# EAGLE design wooden_alarm_simple (EAGLE 9.6.2)
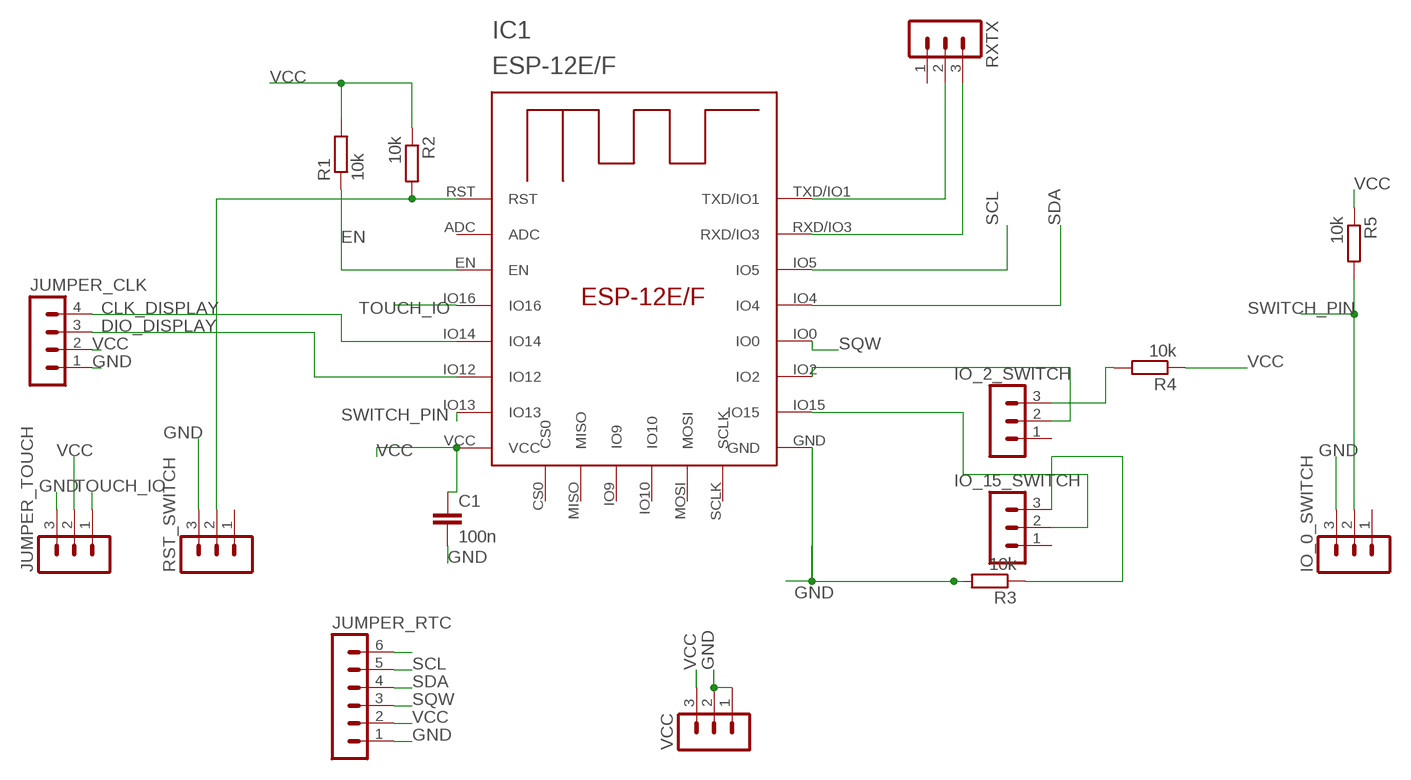
[diagram p0: schematic, sheet 1]

## Parts
C1  100n  C-EUC0805  [C0805]
IC1  ESP-12E/F  [ESP-12E]
IO_0_SWITCH  MA03-1  [MA03-1]
IO_2_SWITCH  MA03-1  [MA03-1]
IO_15_SWITCH  MA03-1  [MA03-1]
JUMPER_CLK  MA04-1  [MA04-1]
JUMPER_RTC  MA06-1  [MA06-1]
JUMPER_TOUCH  MA03-1  [MA03-1]
R1  10k  R-EU_R0805  [R0805]
R2  10k  R-EU_R0805  [R0805]
R3  10k  R-EU_R0805  [R0805]
R4  10k  R-EU_R0805  [R0805]
R5  10k  R-EU_R0805  [R0805]
RST_SWITCH  MA03-1  [MA03-1]
RXTX  MA03-1  [MA03-1]
VCC  MA03-1  [MA03-1]

## Nets
CLK_DISPLAY: IC1.IO14 JUMPER_CLK.4
DIO_DISPLAY: IC1.IO12 JUMPER_CLK.3
EN: IC1.EN R1.1
GND: C1.2 IC1.GND IO_0_SWITCH.3 JUMPER_CLK.1 JUMPER_RTC.1 JUMPER_TOUCH.3 R3.2 RST_SWITCH.3 VCC.1 VCC.2
N$1: IC1.RST R2.2 RST_SWITCH.2
N$2: IO_2_SWITCH.3 R4.2
N$3: IC1.IO15 IO_15_SWITCH.2
N$5: IO_15_SWITCH.3 R3.1
N$7: IC1.IO2 IO_2_SWITCH.2
N$14: JUMPER_RTC.6
RX: IC1.RXD/IO3 RXTX.3
SCL: IC1.IO5 JUMPER_RTC.5
SDA: IC1.IO4 JUMPER_RTC.4
SQW: IC1.IO0 JUMPER_RTC.3
SWITCH_PIN: IC1.IO13 IO_0_SWITCH.2 R5.2
TOUCH_IO: IC1.IO16 JUMPER_TOUCH.1
TX: IC1.TXD/IO1 RXTX.2
VCC: C1.1 IC1.VCC JUMPER_CLK.2 JUMPER_RTC.2 JUMPER_TOUCH.2 R1.2 R2.1 R4.1 R5.1 VCC.3
Unconnected: IC1.ADC IC1.CS0 IC1.IO9 IC1.IO10 IC1.MISO IC1.MOSI IC1.SCLK IO_0_SWITCH.1 IO_2_SWITCH.1 IO_15_SWITCH.1 RST_SWITCH.1 RXTX.1

## Library data of the parts
C1 = rcl:C-EU: CAPACITOR, European symbol; SPICEPREFIX: C
IC1 = esp-12e-f:ESP-12E/F
IO_0_SWITCH IO_2_SWITCH IO_15_SWITCH JUMPER_TOUCH RST_SWITCH RXTX VCC = con-lstb:MA03-1: PIN HEADER; OC_FARNELL: unknown; OC_NEWARK: unknown
JUMPER_CLK = con-lstb:MA04-1: PIN HEADER; OC_FARNELL: unknown; OC_NEWARK: unknown
JUMPER_RTC = con-lstb:MA06-1: PIN HEADER; OC_FARNELL: unknown; OC_NEWARK: unknown
R1-R5 = rcl:R-EU_: RESISTOR, European symbol; SPICEPREFIX: R

## Net classes
0 default: width 0.152 mm, drill 0.1 mm
1 other: width 0.152 mm, drill 0.1 mm, clearance 0.205 mm to class 0, clearance 0.205 mm

## Board
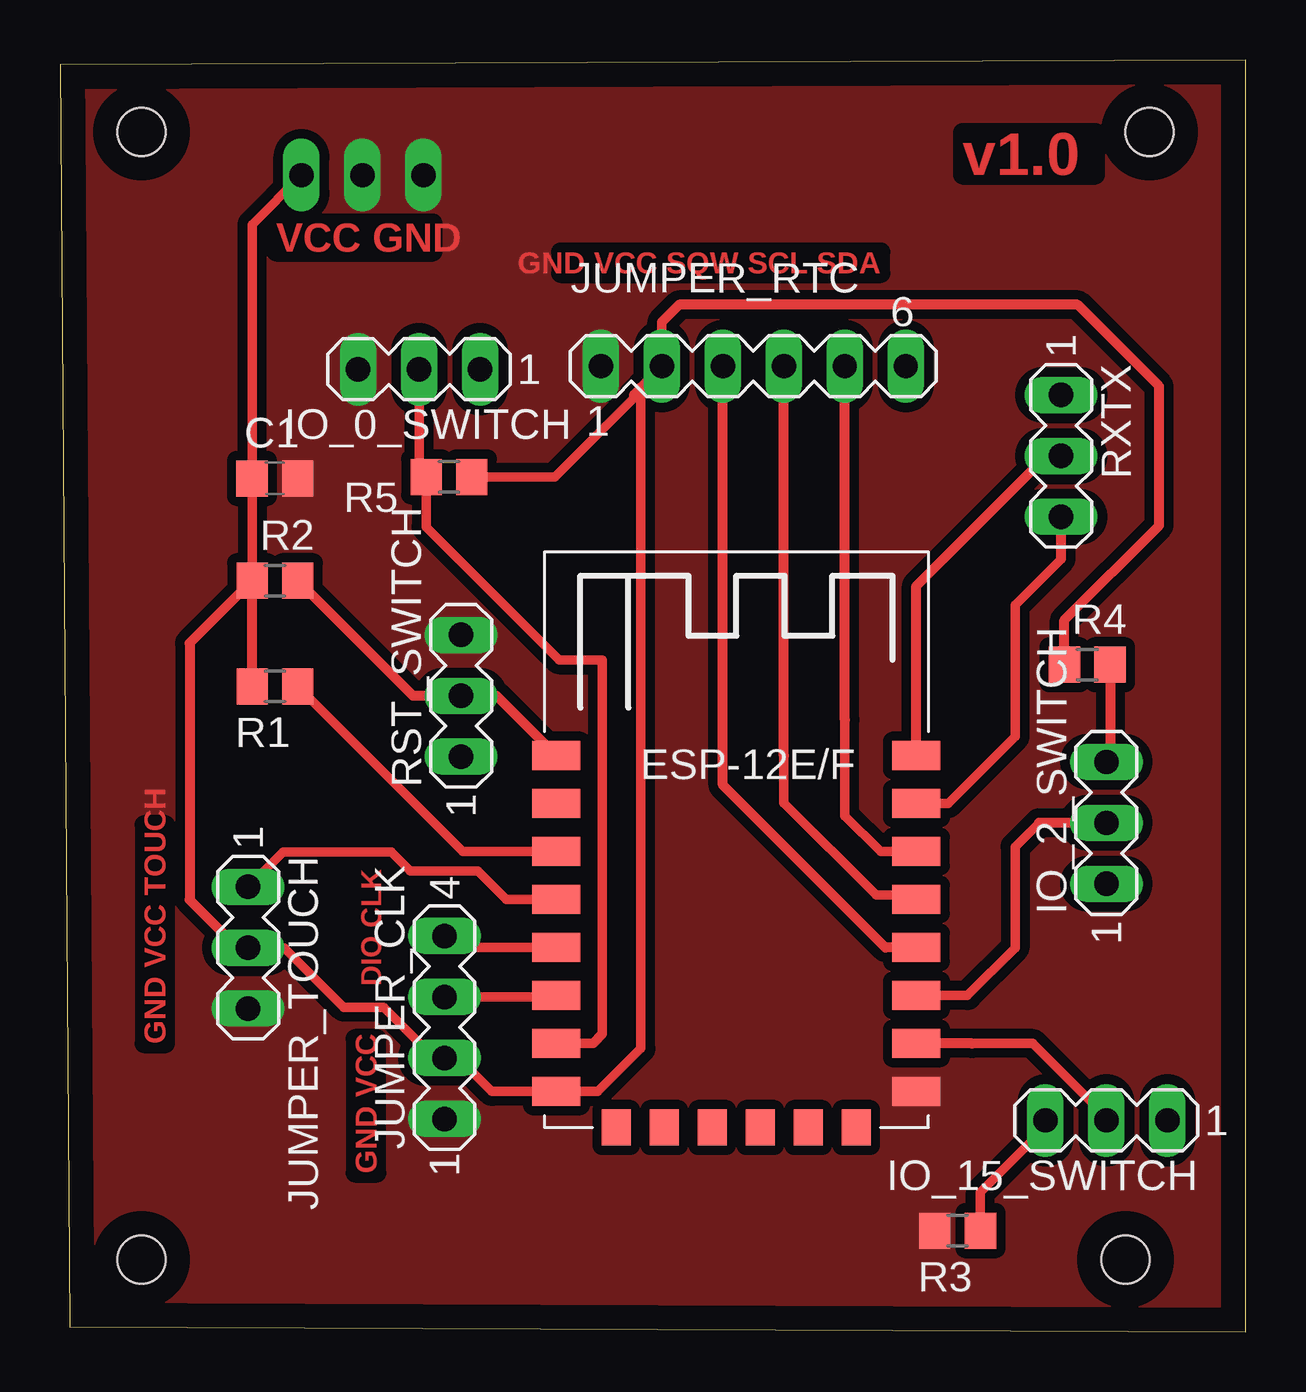
[diagram p1: board, top side]
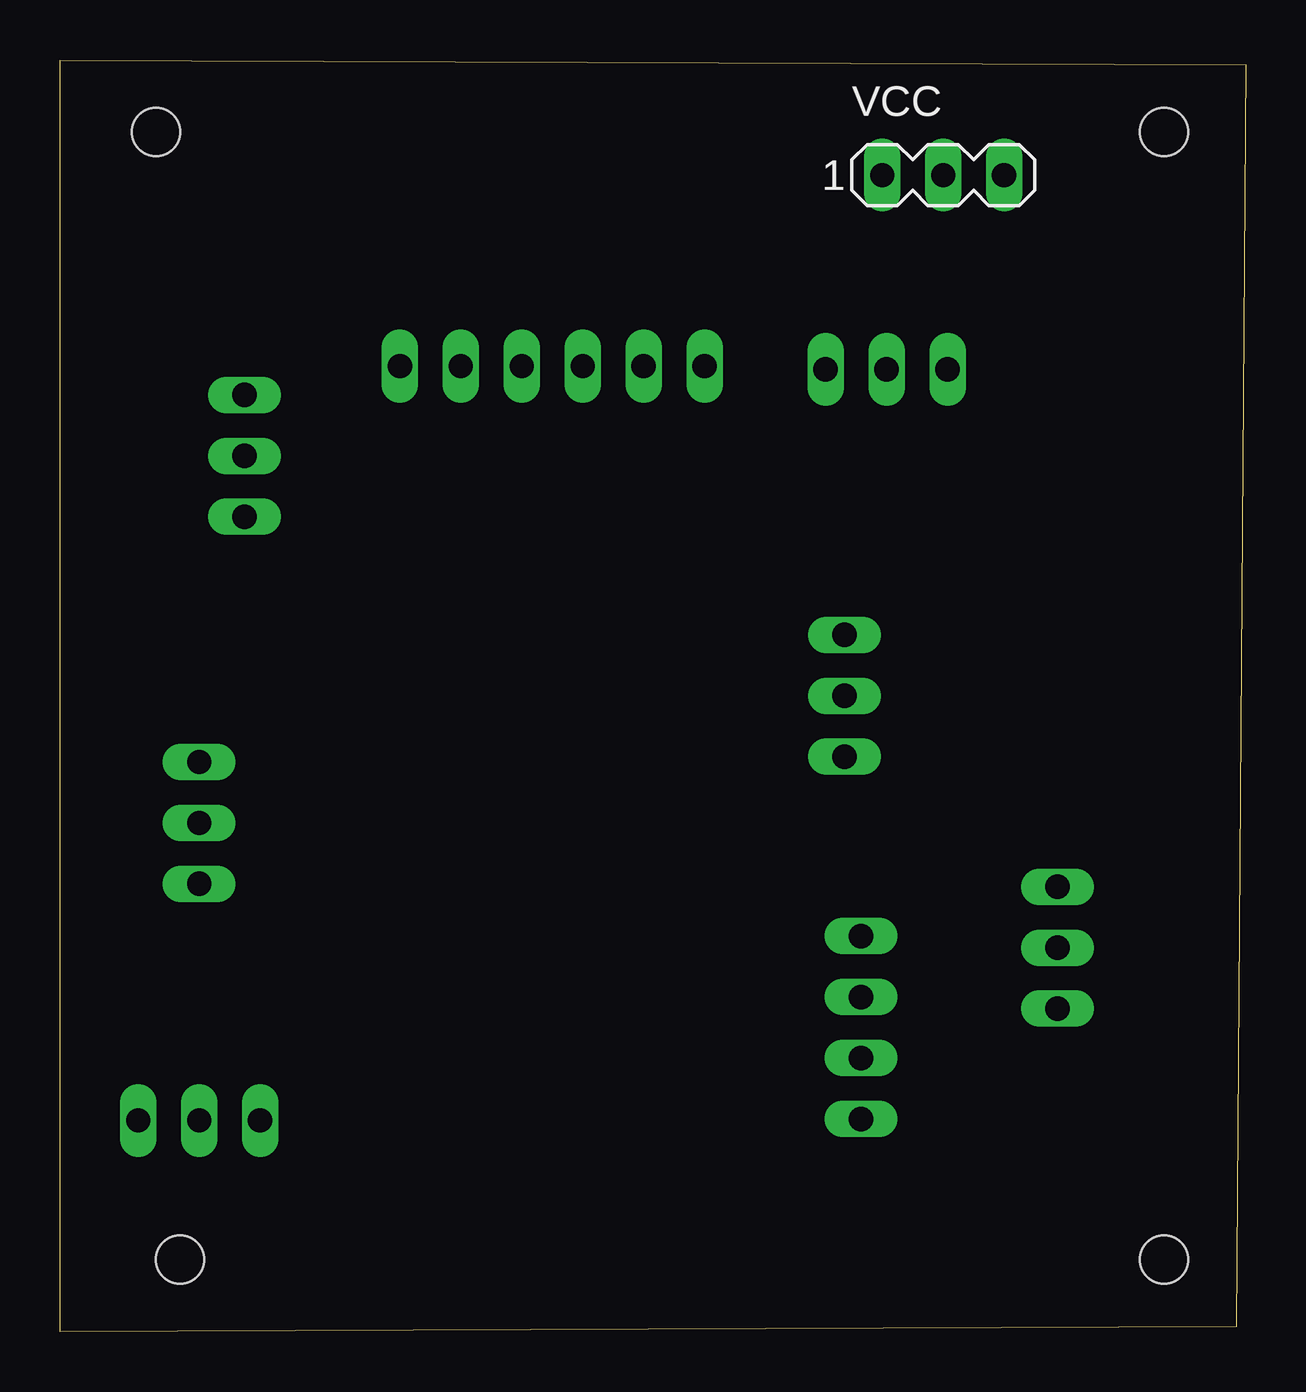
[diagram p2: board, bottom side, seen from below]

Size 49.4 x 53 mm. Coordinates in mm from the lower left corner, seen from the top.
Outline: 0.4,0.2 49.4,0 49.4,53 0,52.8 0.4,0.2
Copper layers (1*16): Top 0.035mm / dielectric 1.5mm / Bottom 0.035mm
Design rules "default *": minimum track width 0.3mm, minimum drill 0.35mm, track to track 0.4mm, track to pad 0.4mm, pad to pad 0.4mm, via to via 0.4mm, smd to smd 6mil, copper to edge 40mil, drill to drill 6mil, minimum pad ring 10mil, minimum via ring 8mil, stop-mask expansion 4mil, vias tented up to drill 0mil, thermal gap 0mil
Holes 2 mm at 44.4,3 3.4,3 45.4,50 3.4,50

### Footprints (pad centres in the part's own frame; a part is rotated, then mirrored left to right if it is on the bottom)
C0805 = smd 1.3 x 1.5: 1 -0.95,0; 2 0.95,0
ESP-12E = smd 2 x 1.2: ADC -7.46,5.53; EN -7.46,3.53; GND 7.54,-6.47; IO0 7.54,-0.47; IO2 7.54,-2.47; IO4 7.54,1.53; IO5 7.54,3.53; IO12 -7.46,-2.47; IO13 -7.46,-4.47; IO14 -7.46,-0.47; IO15 7.54,-4.47; IO16 -7.46,1.53; RST -7.46,7.53; RXD/IO3 7.54,5.53; TXD/IO1 7.54,7.53; VCC -7.46,-6.47 | smd 1.2 x 1.5: CS0 -4.96,-7.97; IO9 -0.96,-7.97; IO10 1.04,-7.97; MISO -2.96,-7.97; MOSI 3.04,-7.97; SCLK 5.04,-7.97
MA03-1 = drill 1.016 long: 1 -2.54,0; 2 0,0; 3 2.54,0
MA04-1 = drill 1.016 long: 1 -3.81,0; 2 -1.27,0; 3 1.27,0; 4 3.81,0
MA06-1 = drill 1.016 long: 1 -6.35,0; 2 -3.81,0; 3 -1.27,0; 4 1.27,0; 5 3.81,0; 6 6.35,0
R0805 = smd 1.3 x 1.5: 1 -0.95,0; 2 0.95,0

### Placement (x,y rotation side)
C1  8.95,35.56 0 top
IC1  28.14,16.48 0 top
IO_0_SWITCH  14.96,40.11 180 top
IO_2_SWITCH  43.6,21.2 90 top
IO_15_SWITCH  43.6,8.8 180 top
JUMPER_CLK  16.02,12.67 90 top
JUMPER_RTC  28.89,40.24 0 top
JUMPER_TOUCH  7.84,16 270 top
R1  8.96,26.89 180 top
R2  8.96,31.3 0 top
R3  37.4,4.2 180 top
R4  42.8,27.8 0 top
R5  16.21,35.62 180 top
RST_SWITCH  16.71,26.5 90 top
RXTX  41.71,36.5 270 top
VCC  12.6,48.2 0 bottom

### Tracks (layer width: path | path; a pad name or v marks a point on that pad's centre or on a via)
CLK_DISPLAY
  Top 0.4: IC1.IO14 16.49,16.01 JUMPER_CLK.4
DIO_DISPLAY
  Top 0.4: IC1.IO12 20.61,13.94 JUMPER_CLK.3
EN
  Top 0.4: IC1.EN 16.79,20.01 R1.1
GND
  pour Top: 0.67,52.26 0.67,0.68 49.09,0.68 49.09,52.26
N$1
  Top 0.406: IC1.RST 18.19,26.5 RST_SWITCH.2 14.71,26.5 R2.2
N$2
  Top 0.406: R4.2 43.75,23.89 IO_2_SWITCH.3
N$3
  Top 0.4: IO_15_SWITCH.2 43.6,8.95 40.54,12.01 38,12.01
  Top 0.406: 38,12.01 IC1.IO15
N$5
  Top 0.4: IO_15_SWITCH.3 41.06,8.51 38.35,5.8 R3.1
N$7
  Top 0.4: 40.8,21.2 39.8,20.2 39.8,16 37.81,14.01 IC1.IO2
  Top 0.406: IO_2_SWITCH.2 40.8,21.2
RX
  Top 0.4: IC1.RXD/IO3 37.01,22.01 39.8,24.8 39.8,30.29 41.71,32.2
  Top 0.406: 41.71,32.2 RXTX.3
SCL
  Top 0.4: IC1.IO5 34.19,20.01 32.7,21.5 32.7,25.5
  Top 0.406: 32.7,25.5 JUMPER_RTC.5
SDA
  Top 0.4: IC1.IO4 35.49,18.2 34,18.2 30.16,22.04 30.16,24
  Top 0.406: 30.16,24 JUMPER_RTC.4
SQW
  Top 0.406: IC1.IO0 34.39,16.01 27.62,22.78 JUMPER_RTC.3
SWITCH_PIN
  Top 0.4: IC1.IO13 22.21,12.01 22.6,12.4 22.6,28 20.8,28 15.26,33.54 R5.2 14.96,35.92 IO_0_SWITCH.2
TOUCH_IO
  Top 0.4: IC1.IO16 18.59,18.01 17.4,19.2 14.6,19.2 13.8,20 9.3,20 JUMPER_TOUCH.1
TX
  Top 0.406: IC1.TXD/IO1 35.68,31.08 41.1,36.5 RXTX.2
VCC
  Top 0.4: JUMPER_RTC.2 24.2,39.36 24.2,11.8 22.41,10.01 IC1.VCC 17.99,10.01 16.6,11.4 JUMPER_CLK.2 15.6,11.4 13.48,13.52 11.83,13.52 9.34,16 JUMPER_TOUCH.2 | JUMPER_RTC.2 23.9,39.06 23.9,38.91 20.61,35.62 R5.1 | R2.1 C1.1 8,46.14 VCC.3 | JUMPER_RTC.2 25.08,42.08
  Top 0.406: R1.2 R2.1 5.4,28.69 5.4,18 7.4,16 JUMPER_TOUCH.2 | R4.1 41.85,29.65 45.8,33.6 45.8,39.4 42.4,42.8 25.8,42.8 25.08,42.08

### Text on the board
Top: v1.0 | VCC GND | GND VCC SQW SCL SDA | DIO CLK | GND VCC TOUCH | GND VCC
tStop: GND VCC SQW SCL SDA | GND VCC TOUCH | GND VCC DIO CLK | v1.0 | GND VCC